# Altium schematic sheet tof_board.SchDoc
size A; SheetNumber: 1; SheetTotal: 1
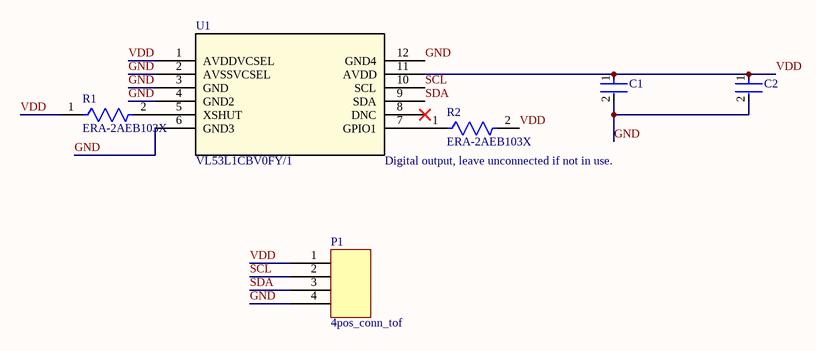
[diagram p0: tof_board.SchDoc]

## Parts
C1  C0402C104K8PACTU  [FP-C0402-BB-MFG]  (value not drawn)
C2  GRM155R60J475ME47D  [FP-GRM155-0_1-IPC_B]  (value not drawn)
P1  4pos_conn_tof  [4pos_conn_tof]
R1  ERA-2AEB103X  [FP-ERA2A-MFG]
R2  ERA-2AEB103X  [FP-ERA2A-MFG]
U1  VL53L1CBV0FY/1  [QFN_BV0FY/1_STM]

## Nets
GND: C1.2 C2.2 P1.4 U1.2(AVSSVCSEL) U1.3(GND) U1.4(GND2) U1.6(GND3) U1.12(GND4)
SCL: P1.2 U1.10(SCL)
SDA: P1.3 U1.9(SDA)
VDD: C1.1 C2.1 P1.1 R1.1 R2.2 U1.1(AVDDVCSEL) U1.11(AVDD)
NetR1_2: R1.2 U1.5(XSHUT)
NetR2_1: R2.1 U1.7(GPIO1)

Not connected (* = marked no-connect by the designer): U1 8(DNC)*

## Notes on the sheet
- Digital output, leave unconnected if not in use.

## Library data of the parts
C1 = CMP-2008-02046-2: CAP CER 0.1UF 10V X5R 0402; Manufacturer: Kemet; Material: Ceramic; Capacitance: 0.10 μF; Temperature Coefficient: 15%; Tolerance: 0.1; Value: 0.10 μF; Package: C0402-BB; Temperature: -55°C to +125°C; ComponentLink2Description: Datasheet; Temperature Characteristic: X5R; Device Class L1: Passive Components; Height: 0.55mm; Lead Free: Yes; ComponentLink2URL: https://content.kemet.com/datasheets/KEM_C1002_X7R_SMD.pdf; Device Class L2: Capacitors; Temperature Range Low: -55°C; Temperature Range High: +125°C; RoHS: TRUE; Octopart: https://octopart.com/c0402c104k8pactu-kemet-140039; Automotive: No; Mouser Description: Capacitor 100 nF 10 VDC 0402; Category: Cap; Voltage Rating: 10 V; Digikey Description: CAP CER 0.1UF 10V X5R 0402; Ipc Land Pattern Name: CAPC10050X50; Device Class L3: Ceramic Capacitors; Manufacturer Part Number: C0402C104K8PACTU
C2 = CMP-2008-04549-2: Chip Multilayer Ceramic Capacitors for General Purpose, 0402, 4.7uF, X5R, 15%, 20%, 6.3V; Height: 0.5mm; Weight: 0.000212oz; Length: 1mm; Case Code (Metric): 1005; Packaging: Tape and Reel; Termination: SMD/SMT; Dielectric: X5R; Depth: 0.5mm; Case Code (Imperial): 0402; Min Operating Temperature: -55°C; Case/Package: 0402; Voltage: 6.3V; Width: 0.02inch; Capacitance: 4.7uF; Lead Free: Lead Free; Thickness: 0.022inch; Contact Plating: Tin; REACH SVHC: No SVHC; Package Quantity: 10000; Tolerance: 20%; Voltage Rating (DC): 6.3V; Voltage Rating: 6.3V; Mount: Surface Mount; Max Operating Temperature: 85°C
R1 R2 = CMP-2002-05875-2: RES SMD 10K OHM 0.1% 1/16W 0402; Manufacturer: Panasonic; Temperature Coefficient: 25ppm/°C; Automotive Grade: Grade 0; Resistance: 10kΩ; Power Rating: 0.063W; Voltage Rating: 50V; Value: 10kΩ; Description: 10 kOhms ±0.1% 0.063W, 1/16W Chip Resistor 0402 (1005 Metric) Automotive AEC-Q200 Thin Film; RoHS: TRUE; Device Class L3: Chip SMD Resistors; Automotive: Yes; Series: ERA; Height: 0.4mm; Package: ERA2A; Temperature Range Low: -55°C; ComponentLink2Description: Datasheet; Tolerance: 0.1%; Device Class L2: Resistors; Temperature Range High: +155°C; Device Class L1: Passive Components; Digikey Description: RES SMD 10K OHM 0.1% 1/16W 0402; Manufacturer Part Number: ERA-2AEB103X; Category: Res; Mouser Description: Thin Film Resistors - SMD 0402 1/16W 10Kohms; Lead Free: Yes; Footprint Url: https://industrial.panasonic.com/cdbs/www-data/pdf/RDM0000/DMM0000COL17.pdf; Composition: Metal Film; Octopart: https://octopart.com/era-2aeb103x-panasonic-9251377; ComponentLink2URL: https://industrial.panasonic.com/cdbs/www-data/pdf/RDM0000/AOA0000C307.pdf; Temperature: -55°C to +155°C
U1 = VL53L1CBV0FY/1: No Description Available; Mfr_Name: STMicroelectronics; Copyright: Copyright (C) 2022 Ultra Librarian. All rights reserved.; Manufacturer_Part_Number: VL53L1CBV0FY/1; RefDes: RefDes; Type: DEV